# EAGLE design Bubba (EAGLE 9.6.2)
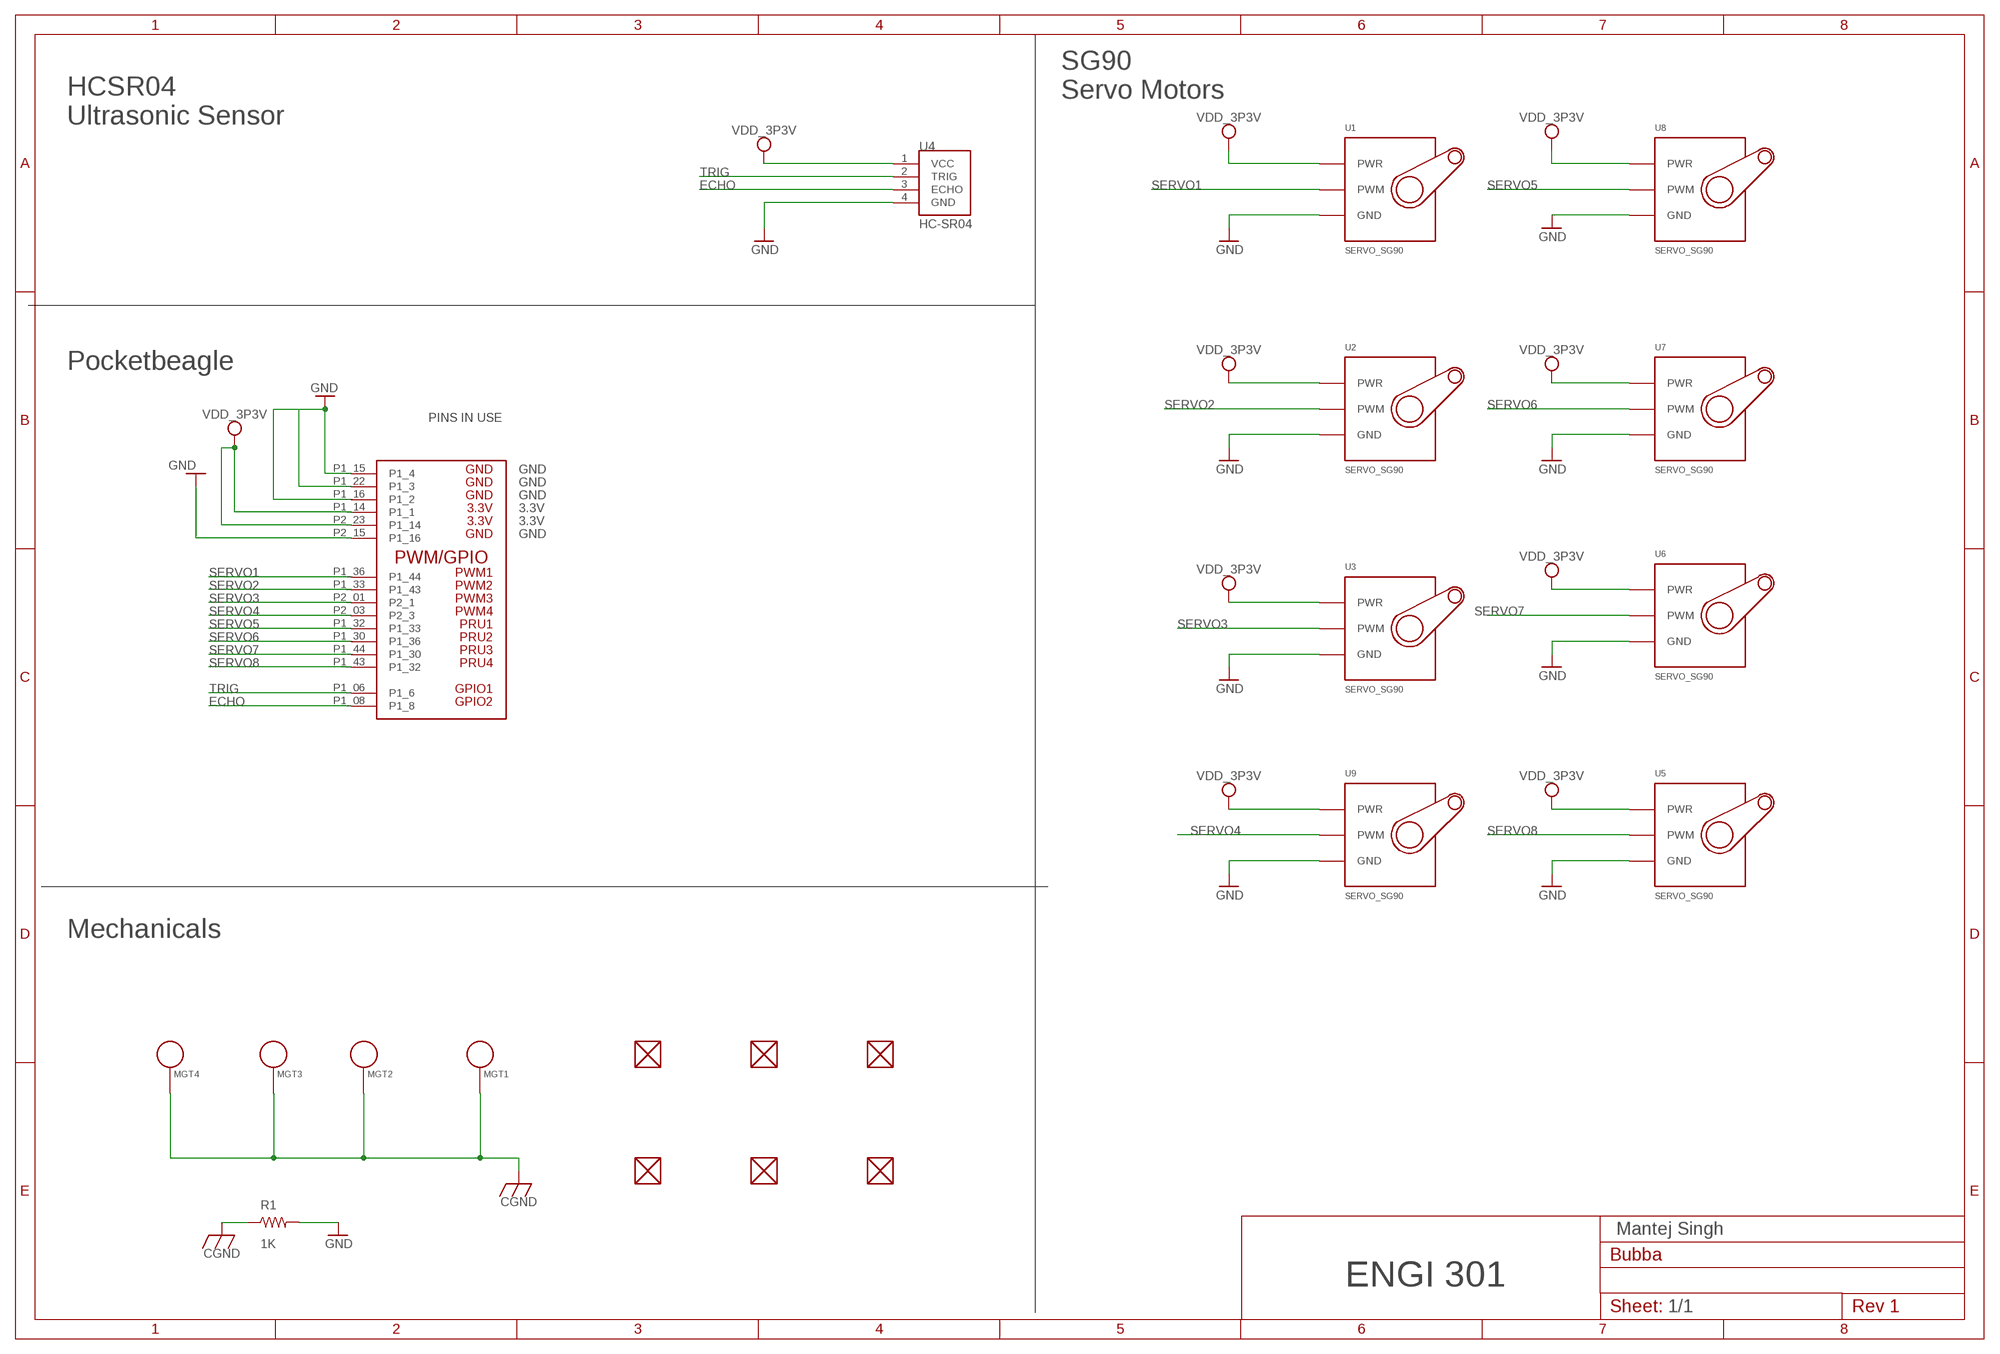
[diagram p0: schematic, sheet 1]

## Parts
FUD1  FIDUCIAL  [FIDUCIAL_40MIL]
FUD2  FIDUCIAL  [FIDUCIAL_40MIL]
FUD3  FIDUCIAL  [FIDUCIAL_40MIL]
FUD4  FIDUCIAL  [FIDUCIAL_40MIL]
FUD5  FIDUCIAL  [FIDUCIAL_40MIL]
FUD6  FIDUCIAL  [FIDUCIAL_40MIL]
MGT1  MOUNTING_HOLE  [MOUNTING_HOLE]
MGT2  MOUNTING_HOLE  [MOUNTING_HOLE]
MGT3  MOUNTING_HOLE  [MOUNTING_HOLE]
MGT4  MOUNTING_HOLE  [MOUNTING_HOLE]
R1  1K  R_R0805  [R0805]
U1  SERVO_SG90  [SERVO-X1]
U2  SERVO_SG90  [SERVO-X1]
U3  SERVO_SG90  [SERVO-X1]
U4  HC-SR04  [XCVR_HC-SR04]
U5  SERVO_SG90  [SERVO-X1]
U6  SERVO_SG90  [SERVO-X1]
U7  SERVO_SG90  [SERVO-X1]
U8  SERVO_SG90  [SERVO-X1]
U9  SERVO_SG90  [SERVO-X1]
U$1  POCKETBEAGLE-MANTEJ  [POCKETBEAGLE-MANTEJ]

## Nets
CGND: MGT1.P$1 MGT2.P$1 MGT3.P$1 MGT4.P$1 R1.1
ECHO: U4.3(ECHO) U$1.P1_08(P1_8)
GND: R1.2 U1.GND U2.GND U3.GND U4.4(GND) U5.GND U6.GND U7.GND U8.GND U9.GND U$1.P1_15(P1_4) U$1.P1_16(P1_2) U$1.P1_22(P1_3) U$1.P2_15(P1_16)
SERVO1: U1.SIG(PWM) U$1.P1_36(P1_44)
SERVO2: U2.SIG(PWM) U$1.P1_33(P1_43)
SERVO3: U3.SIG(PWM) U$1.P2_01(P2_1)
SERVO4: U9.SIG(PWM) U$1.P2_03(P2_3)
SERVO5: U8.SIG(PWM) U$1.P1_32(P1_33)
SERVO6: U7.SIG(PWM) U$1.P1_30(P1_36)
SERVO7: U6.SIG(PWM) U$1.P1_44(P1_30)
SERVO8: U5.SIG(PWM) U$1.P1_43(P1_32)
TRIG: U4.2(TRIG) U$1.P1_06(P1_6)
VDD_3P3V: U1.PWR U2.PWR U3.PWR U4.1(VCC) U5.PWR U6.PWR U7.PWR U8.PWR U9.PWR U$1.P1_14(P1_1) U$1.P2_23(P1_14)
Unconnected: FUD1.P$1 FUD2.P$1 FUD3.P$1 FUD4.P$1 FUD5.P$1 FUD6.P$1

## Notes on the sheet
- SG90
  Servo Motors
- HCSR04
  Ultrasonic Sensor
- Pocketbeagle
- Mechanicals
- Mantej Singh
- ENGI 301
- 1/1

## Library data of the parts
FUD1-FUD6 = combo_lock:FIDUCIAL
MGT1-MGT4 = combo_lock:MOUNTING_HOLE: Chassis Mounting Hole w/GND connection ability
R1 = combo_lock:R_: RESISTOR, American symbol
U1-U3 U5-U9 = Bubba:SERVO_SG90
U4 = Bubba:HC-SR04: Ultrasonic Sensor Module Check prices <https://pricing.snapeda.com/parts/HC-SR04/SparkFun%20Electronics/view-part?ref=eda>; AVAILABILITY: Not in stock; DESCRIPTION: Multiple Function Sensor Development Tools Ultrasonic Sensor Module; MF: SparkFun Electronics; MP: HC-SR04; PACKAGE: None; PRICE: None
U$1 = Bubba:POCKETBEAGLE-MANTEJ

## Board
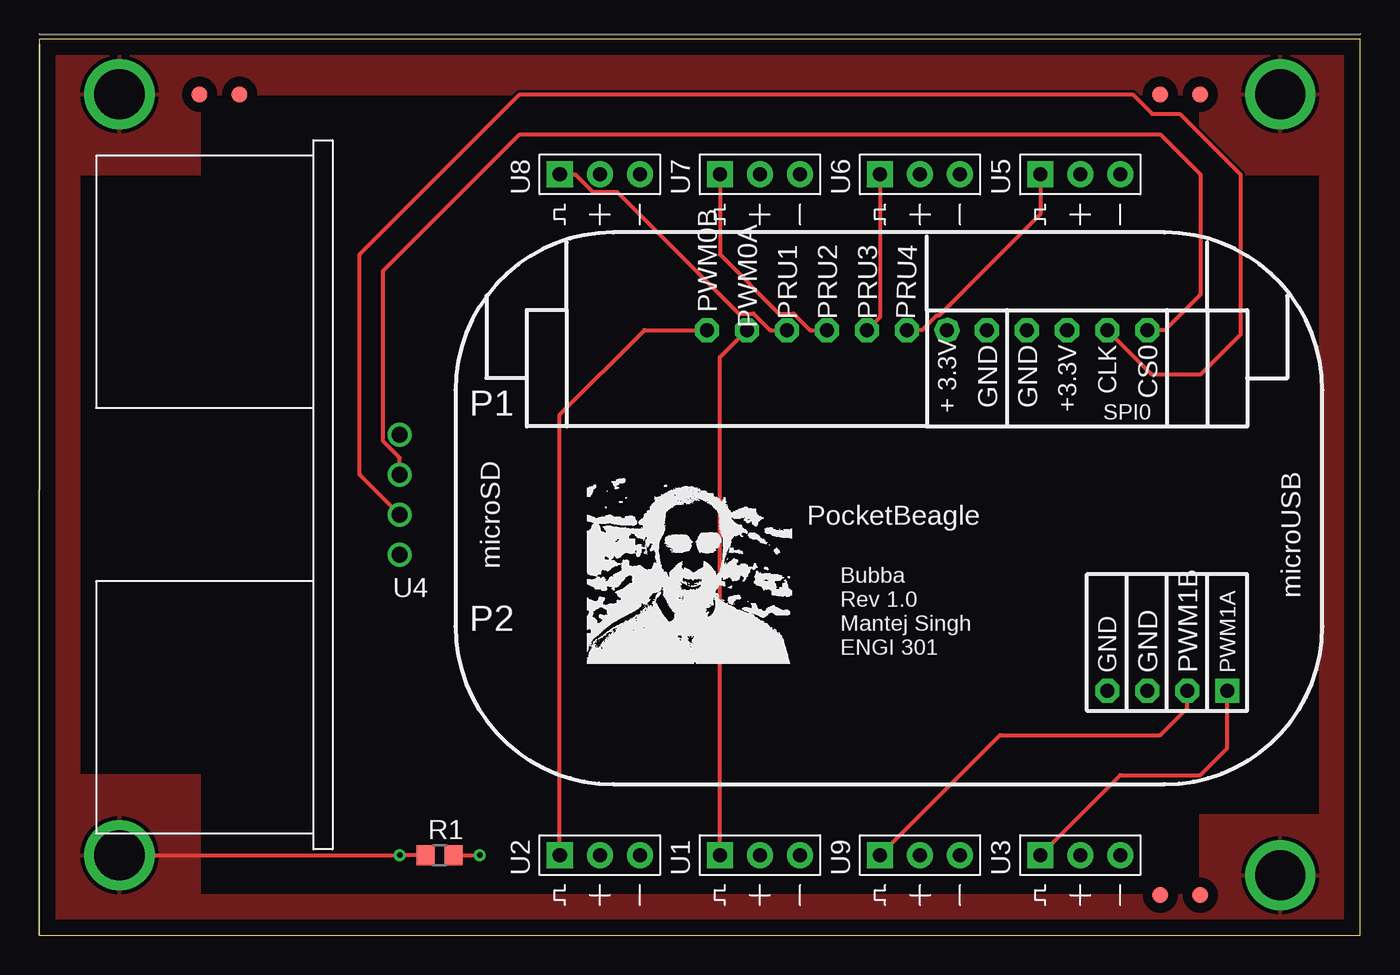
[diagram p1: board, top side]
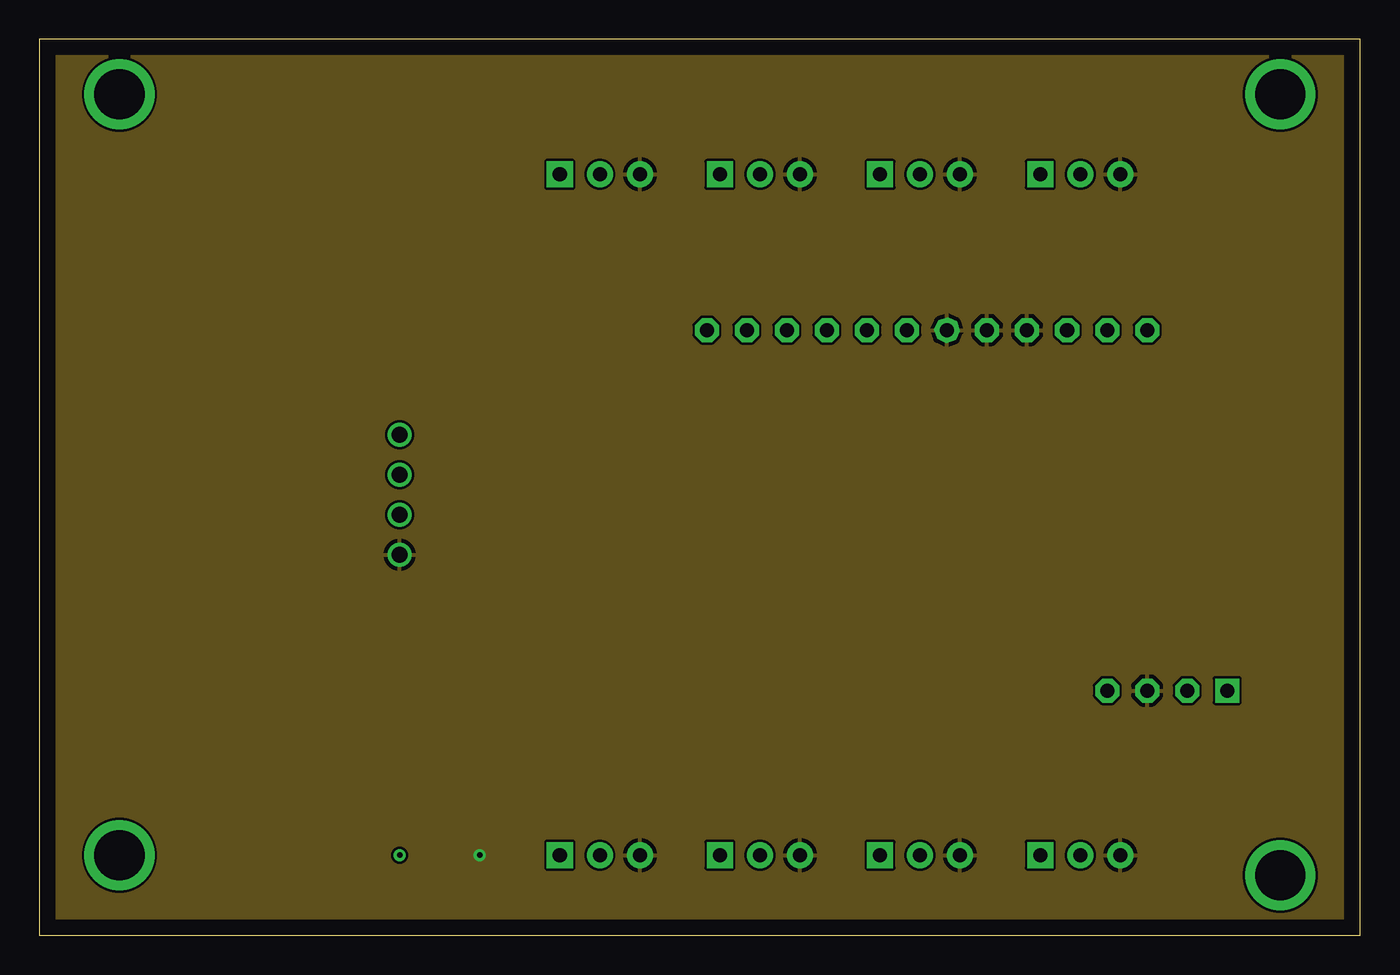
[diagram p2: board, inner layer Route2]
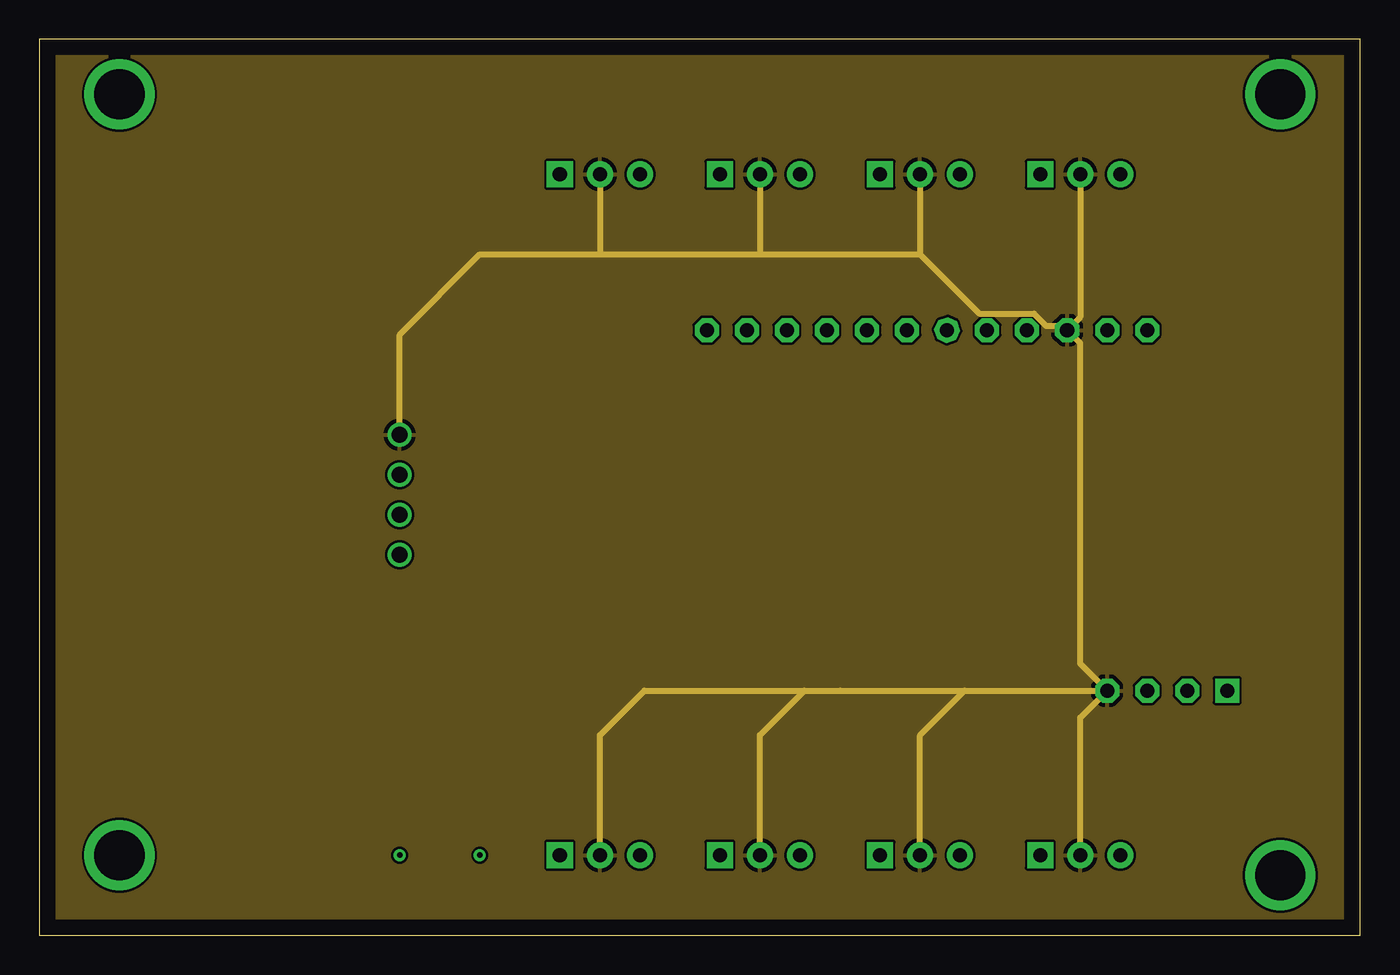
[diagram p3: board, inner layer Route15]
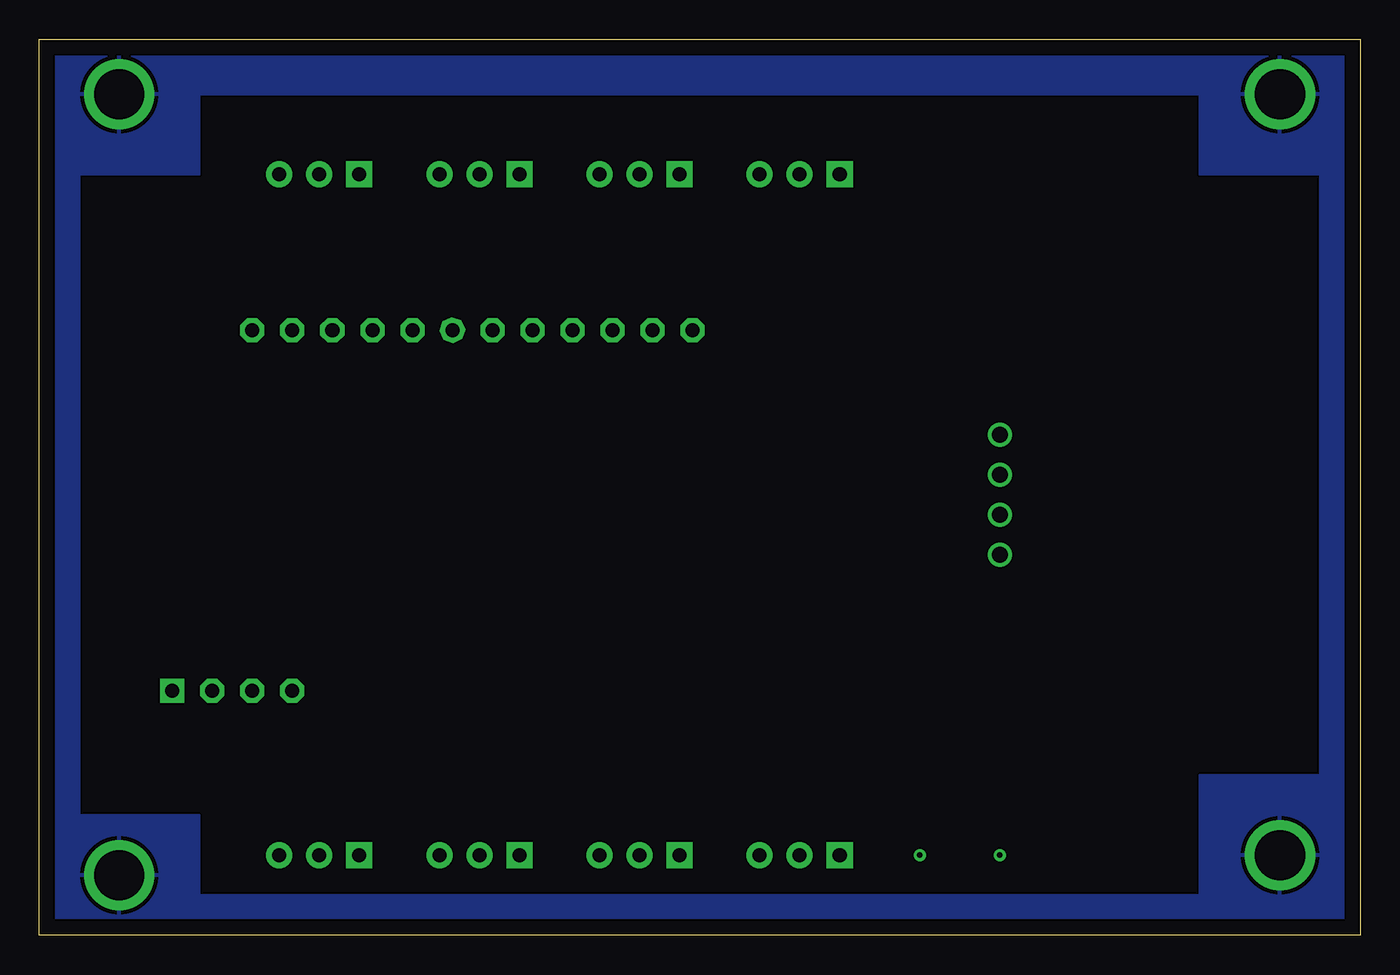
[diagram p4: board, bottom side, seen from below]

Size 83.8 x 56.82 mm. Coordinates in mm from the lower left corner, seen from the top.
Outline: 0,0 83.8,0 83.8,56.82 0,56.82 0,0
Copper layers (1+2*15+16): Top 0.035mm / dielectric 1.5mm / Route2 0.035mm / dielectric 0.15mm / Route15 0.035mm / dielectric 0.2mm / Bottom 0.035mm
Design rules "default *": minimum track width 6mil, minimum drill 0.35mm, track to track 6mil, track to pad 6mil, pad to pad 6mil, via to via 6mil, smd to smd 6mil, copper to edge 40mil, drill to drill 6mil, minimum pad ring 10mil, minimum via ring 8mil, stop-mask expansion 4mil, vias tented up to drill 0mil, thermal gap 10mil

### Footprints (pad centres in the part's own frame; a part is rotated, then mirrored left to right if it is on the bottom)
FIDUCIAL_40MIL = smd 1.016 x 1.016: P$1 0,0
MOUNTING_HOLE = drill 3.175 pad 4.445: P$1 0,0
R0805 = smd 1.143 x 1.27: 1 -0.889,0; 2 0.889,0
SERVO-X1 = drill 0.889 pad 1.651: GND 0,-2.54; PWR 0,0 | drill 0.889 pad 1.651 square: SIG 0,2.54
XCVR_HC-SR04 = drill 1.02: 1 -3.81,0; 2 -1.27,0; 3 1.27,0; 4 3.81,0
POCKETBEAGLE-MANTEJ = drill 0.889 pad 1.524 octagon: P1_06 10.99,6.07; P1_08 13.53,6.07; P1_14 16.07,6.07; P1_15 23.69,6.07; P1_16 18.61,6.07; P1_22 21.15,6.07; P1_30 31.31,6.07; P1_32 33.85,6.07; P1_33 38.93,6.07; P1_36 36.39,6.07; P1_43 26.23,6.07; P1_44 28.77,6.07; P2_03 8.45,28.93; P2_15 10.99,28.93; P2_23 13.53,28.93 | drill 0.889 pad 1.524 square: P2_01 5.91,28.93

### Placement (x,y rotation side)
FUD1  71.12,53.34 0 top
FUD2  71.12,2.54 0 top
FUD3  73.66,2.54 0 top
FUD4  12.7,53.34 0 top
FUD5  73.66,53.34 0 top
FUD6  10.16,53.34 0 top
MGT1  5.08,5.08 0 top
MGT2  78.74,3.81 0 top
MGT3  78.74,53.34 0 top
MGT4  5.08,53.34 0 top
R1  25.4,5.08 0 top
U1  45.72,5.08 90 top
U2  35.56,5.08 90 top
U3  66.04,5.08 90 top
U4  22.86,27.94 270 top
U5  66.04,48.26 90 top
U6  55.88,48.26 90 top
U7  45.72,48.26 90 top
U8  35.56,48.26 90 top
U9  55.88,5.08 90 top
U$1  81.28,44.45 180 top

### Tracks (layer width: path | path; a pad name or v marks a point on that pad's centre or on a via)
CGND  (via drill 0.35)
  Top 0.254: R1.1 v22.86,5.08 MGT1.P$1
  pour Bottom: -2.54,27.94 -2.54,58.42 86.36,58.42 86.36,27.94 81.28,27.94 81.28,48.26 73.66,48.26 73.66,53.34 10.16,53.34 10.16,48.26 2.54,48.26 2.54,27.94
  pour Bottom: -2.54,27.94 -2.54,-2.54 86.36,-2.54 86.36,27.94 81.28,27.94 81.28,7.62 73.66,7.62 73.66,2.54 10.16,2.54 10.16,10.16 2.54,10.16 2.54,27.94
  pour Top: -2.54,27.94 2.54,27.94 2.54,48.26 10.16,48.26 10.16,53.34 73.66,53.34 73.66,48.26 81.28,48.26 81.28,27.94 86.36,27.94 86.36,58.42 -2.54,58.42
  pour Top: -2.54,27.94 2.54,27.94 2.54,10.16 10.16,10.16 10.16,2.54 73.66,2.54 73.66,7.62 81.28,7.62 81.28,27.94 86.36,27.94 86.36,-2.54 -2.54,-2.54
ECHO
  Top 0.254: U4.3 20.32,29.21 20.32,43.18 30.48,53.34 69.37,53.34 70.61,52.1 72.36,52.1 76.2,48.26 76.2,38.1 73.66,35.56 70.57,35.56 U$1.P1_08
GND  (via drill 0.35)
  Top 0.254: R1.2 v27.94,5.08
  pour Route2: -2.54,58.42 86.36,58.42 86.36,-2.54 -2.54,-2.54
SERVO1
  Top 0.254: U$1.P1_36 43.18,36.67 U1.SIG
SERVO2
  Top 0.254: U2.SIG 33.02,33.02 38.38,38.38 U$1.P1_33
SERVO3
  Top 0.254: U3.SIG 68.58,10.16 73.66,10.16 75.37,11.87 U$1.P2_01
SERVO4
  Top 0.254: U9.SIG 60.96,12.7 71.12,12.7 72.83,14.41 U$1.P2_03
SERVO5
  Top 0.254: U8.SIG 34,48.26 35.1,47.16 36.67,47.16 44.4,39.42 45.32,39.42 46.36,38.38 U$1.P1_32
SERVO6
  Top 0.254: U7.SIG 43.18,43.18 46.94,39.42 47.86,39.42 48.9,38.38 U$1.P1_30
SERVO7
  Top 0.254: U$1.P1_44 53.34,39.21 U6.SIG
SERVO8
  Top 0.254: U5.SIG 63.5,45.72 57.09,39.31 56.93,39.31 56,38.38 U$1.P1_43
TRIG
  Top 0.254: U4.2 22.86,30.27 21.82,31.32 21.82,42.14 30.48,50.8 71.12,50.8 73.66,48.26 73.66,40.64 71.4,38.38 U$1.P1_06
VDD_3P3V
  Route15 0.381: U$1.P2_23 66.04,17.23 66.04,37.55 U$1.P1_14 | U$1.P1_14 65.48,38.66 63.87,38.66 63.1,39.42 59.64,39.42 55.88,43.18 | U$1.P2_23 66.04,13.81 U3.PWR | U9.PWR 55.88,12.7 58.7,15.52 | 58.7,15.52 U$1.P2_23 | U7.PWR 45.72,43.18 | 45.72,43.18 55.88,43.18 | U8.PWR 35.56,43.18 | 35.56,43.18 45.72,43.18 | U4.1 22.86,38.1 27.94,43.18 35.56,43.18 | U$1.P1_14 66.04,39.21 U5.PWR | U6.PWR 55.88,43.18 | U1.PWR 45.72,12.7 48.54,15.52 | 48.54,15.52 50.8,15.52 58.7,15.52 | U2.PWR 35.56,12.7 38.38,15.52 48.54,15.52
  pour Route15 (rank 6): -5.08,60.96 88.9,60.96 88.9,-5.08 -5.08,-5.08

### Text on the board
tPlace: Bubba / Rev 1.0 / Mantej Singh / ENGI 301
201bmp: /Users/mantejsingh/Downloads/luna3.bmp